# EAGLE design SPARC_Gamma LED PCB (EAGLE 9.6.2)
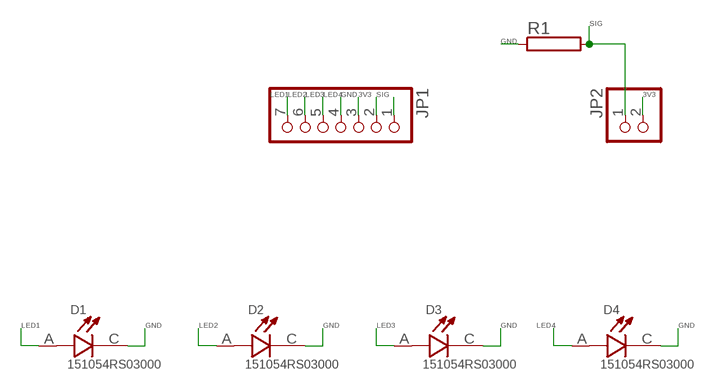
[diagram p0: schematic, sheet 1]

## Parts
D1  151054RS03000  [LED_151054RS03000]
D2  151054RS03000  [LED_151054RS03000]
D3  151054RS03000  [LED_151054RS03000]
D4  151054RS03000  [LED_151054RS03000]
JP1  PINHD-1X7  [1X07]
JP2  PINHD-1X2  [1X02]
R1  RAC01  [AC01]

## Nets
3V3: JP1.2 JP2.2
GND: D1.C D2.C D3.C D4.C JP1.3 R1.1
LED1: D1.A JP1.7
LED2: D2.A JP1.6
LED3: D3.A JP1.5
LED4: D4.A JP1.4
SIG: JP1.1 JP2.1 R1.2

## Library data of the parts
D1-D4 = LED 5V:151054RS03000: Red 623nm LED Indication - Discrete 1.9V Radial Check availability <https://pricing.snapeda.com/parts/151054RS03000/W%C3%BCrth%20Elektronik/view-part?ref=eda>; AVAILABILITY: In Stock; CHECK_PRICES: https://www.snapeda.com/parts/151054RS03000/Wurth+Elektronik/view-part/?ref=eda; DESCRIPTION: Red 623nm LED Indication - Discrete 1.9V Radial; MF: Würth Elektronik; MP: 151054RS03000; PACKAGE: Radial Würth Elektronik; PRICE: None; PURCHASE-URL: https://www.snapeda.com/api/url_track_click_mouser/?unipart_id=4872316&manufacturer=Würth Elektronik&part_name=151054RS03000&search_term=led; SNAPEDA_LINK: https://www.snapeda.com/parts/151054RS03000/Wurth+Elektronik/view-part/?ref=snap
JP1 = pinhead:PINHD-1X7: PIN HEADER
JP2 = pinhead:PINHD-1X2: PIN HEADER
R1 = resistor-power:R: Power Resitor; OC_FARNELL: unknown; OC_NEWARK: unknown

## Board
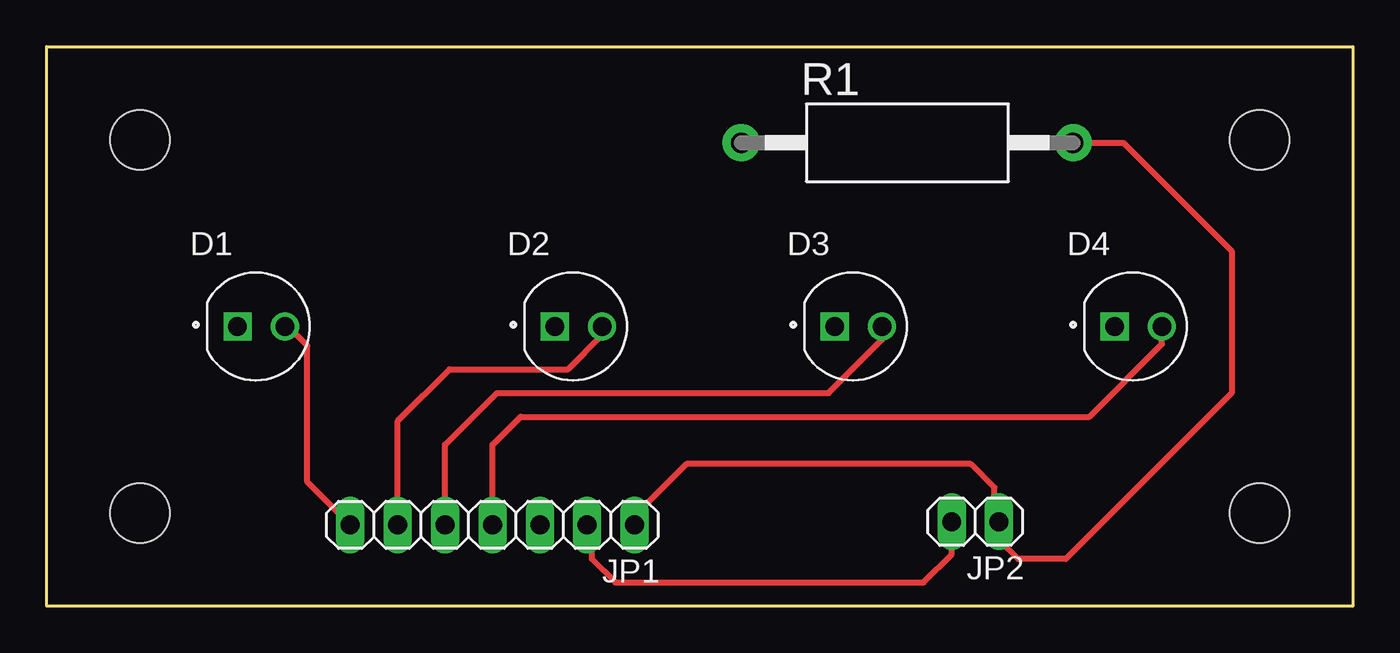
[diagram p1: board, top side]
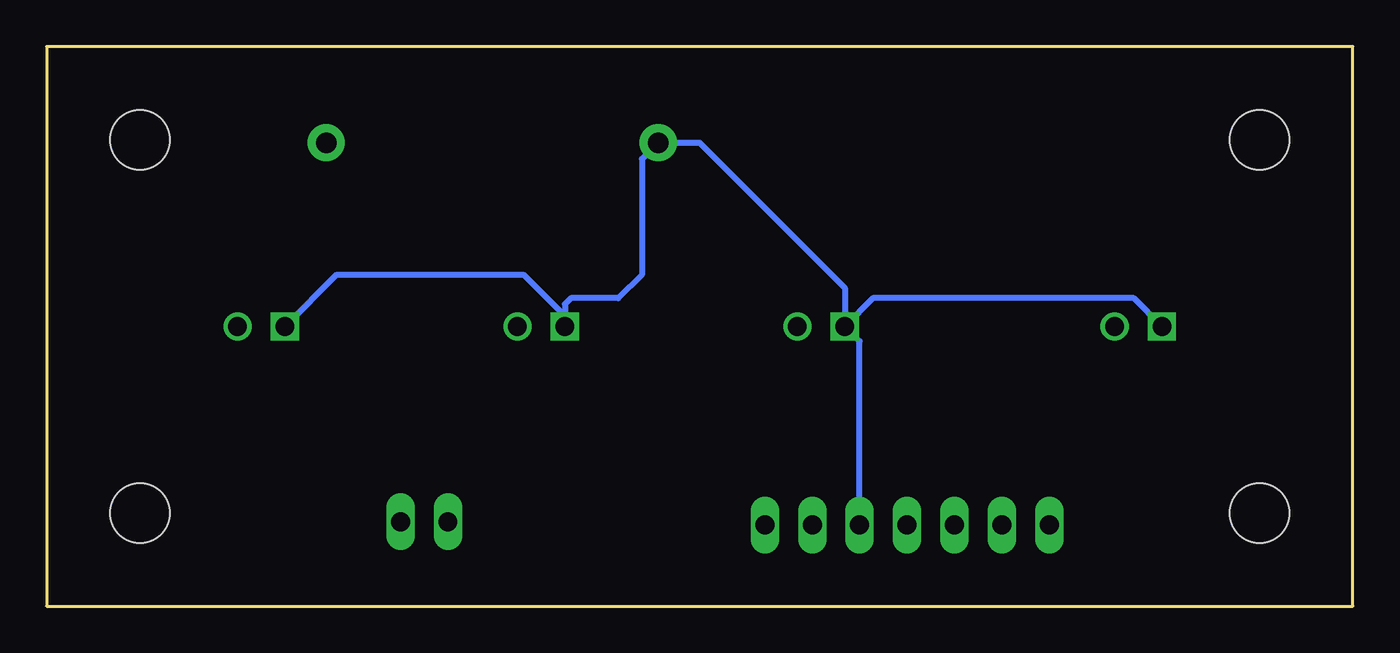
[diagram p2: board, bottom side, seen from below]

Size 70 x 30 mm. Coordinates in mm from the lower left corner, seen from the top.
Outline: 0,0 0,30 70,30 70,0 0,0
Copper layers (1*16): Top 0.035mm / dielectric 1.5mm / Bottom 0.035mm
Design rules "default": minimum track width 6mil, minimum drill 0.35mm, track to track 6mil, track to pad 6mil, pad to pad 6mil, via to via 6mil, smd to smd 6mil, copper to edge 40mil, drill to drill 6mil, minimum pad ring 10mil, minimum via ring 8mil, stop-mask expansion 4mil, vias tented up to drill 0mil, thermal gap 10mil
Holes 3.2 mm at 5,25 5,5 65,25 65,5

### Footprints (pad centres in the part's own frame; a part is rotated, then mirrored left to right if it is on the bottom)
LED_151054RS03000 = drill 1: A 1.27,0 | drill 1 square: C -1.27,0
1X07 = drill 1.016 long: 1 -7.62,0; 2 -5.08,0; 3 -2.54,0; 4 0,0; 5 2.54,0; 6 5.08,0; 7 7.62,0
1X02 = drill 1.016 long: 1 -1.27,0; 2 1.27,0
AC01 = drill 1.1 pad 2: 1 -8.9,0; 2 8.9,0

### Placement (x,y rotation side)
D1  11.5,15 0 top
D2  28.5,15 0 top
D3  43.5,15 0 top
D4  58.5,15 0 top
JP1  23.89,4.36 180 top
JP2  49.77,4.53 180 top
R1  46.12,24.85 0 top

### Tracks (layer width: path | path; a pad name or v marks a point on that pad's centre or on a via)
3V3
  Top 0.32: JP1.2 29.21,4.12 29.21,2.54 30.48,1.27 46.99,1.27 48.5,2.78 JP2.2
GND
  Bottom 0.32: D1.C 11.74,16.51 25.72,16.51 D2.C | D2.C 27.23,17.07 35.01,24.85 R1.1 38.1,23.97 38.1,17.78 39.37,16.51 41.91,16.51 42.23,16.19 42.23,15.56 | D4.C 54.45,17.78 44.45,17.78 42.23,15.56 | 42.23,15.56 D3.C | JP1.3 26.43,14.2 D2.C
LED1
  Top 0.32: JP1.7 13.97,6.66 13.97,13.97 12.94,15 D1.A
LED2
  Top 0.32: JP1.6 18.81,9.92 21.59,12.7 27.94,12.7 29.77,14.53 D2.A
LED3
  Top 0.32: JP1.5 21.35,8.65 24.13,11.43 41.91,11.43 44.77,14.29 D3.A
LED4
  Top 0.32: JP1.4 23.89,8.65 25.4,10.16 55.88,10.16 59.77,14.05 D4.A
SIG
  Top 0.32: JP1.1 31.51,4.84 34.29,7.62 49.53,7.62 50.8,6.35 50.8,4.77 JP2.1 51.04,3.57 52.07,2.54 54.61,2.54 63.5,11.43 63.5,19.05 57.7,24.85 R1.2